# Altium schematic sheet Arduino幻彩灯带.SchDoc
size A3
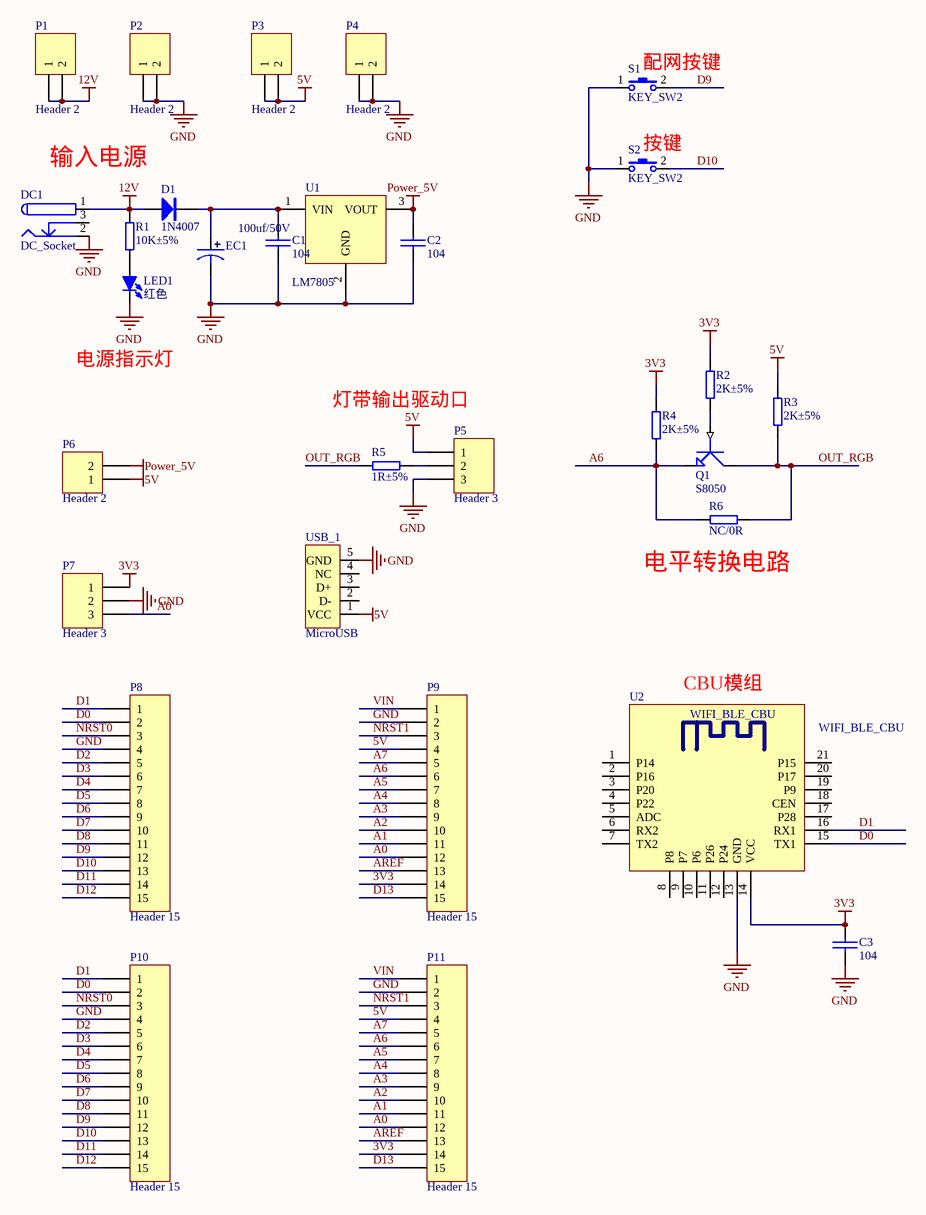
[diagram p0: Arduino幻彩灯带.SchDoc]

## Parts
C1  104  [0805C]
C2  104  [0805C]
C3  104  [0805C]
D1  1N4007  [SMA]
DC1  DC_Socket  [DC-005]
EC1  100uf/50V  [DIP-EC3.5X8X11.5]
LED1  红色  [LED 0603R]
P1  Header 2  [HDR1X2]
P2  Header 2  [HDR1X2]
P3  Header 2  [HDR1X2]
P4  Header 2  [HDR1X2]
P5  Header 3  [HDR1X3]
P6  Header 2  [HDR1X2]
P7  Header 3  [HDR1X3]
P8  Header 15  [HDR1X15]
P9  Header 15  [HDR1X15]
P10  Header 15  [HDR1X15]
P11  Header 15  [HDR1X15]
Q1  S8050  [SOT-23-NPN]
R1  10K±5%  [R0805]
R2  2K±5%  [R0603]
R3  2K±5%  [R0603]
R4  2K±5%  [R0603]
R5  1R±5%  [R0603]
R6  NC/0R  [R0603]
S1  KEY_SW2  [KEY4-SMD]
S2  KEY_SW2  [KEY4-SMD]
U1  LM7805  [TO252]
U2  WIFI_BLE_CBU  [WIFI_BLE_CBU]
USB_1  MicroUSB  [USB-micro_A]

## Nets
3V3: C3.1 P7.1 P9.14 P11.14 R2.1 R4.1 U2.14(VCC)
5V: P3.1 P3.2 P5.1 P6.1 P9.4 P11.4 R3.1 USB_1.1(VCC)
12V: D1.1(A) DC1.1 P1.1 P1.2 R1.1
GND: C1.1 C2.1 C3.2 DC1.2 EC1.2 LED1.2(K) P2.1 P2.2 P4.1 P4.2 P5.3 P7.2 P8.4 P9.2 P10.4 P11.2 S1.1 S2.1 U1.2(GND) U2.13(GND) USB_1.5(GND)
Power_5V: C2.2 P6.2 U1.3(VOUT)
A0: P7.3 P9.12 P11.12
A1: P9.11 P11.11
A2: P9.10 P11.10
A3: P9.9 P11.9
A4: P9.8 P11.8
A5: P9.7 P11.7
A6: P9.6 P11.6 Q1.1(E) R4.2 R6.1
A7: P9.5 P11.5
AREF: P9.13 P11.13
D0: P8.2 P10.2 U2.15(TX1)
D1: P8.1 P10.1 U2.16(RX1)
D2: P8.5 P10.5
D3: P8.6 P10.6
D4: P8.7 P10.7
D5: P8.8 P10.8
D6: P8.9 P10.9
D7: P8.10 P10.10
D8: P8.11 P10.11
D9: P8.12 P10.12 S1.2
D10: P8.13 P10.13 S2.2
D11: P8.14 P10.14
D12: P8.15 P10.15
D13: P9.15 P11.15
NRST0: P8.3 P10.3
NRST1: P9.3 P11.3
OUT_RGB: Q1.3(C) R3.2 R5.1 R6.2
VIN: P9.1 P11.1
NetC1_2: C1.2 D1.2(K) EC1.1 U1.1(VIN)
NetLED1_1: LED1.1(A) R1.2
NetP5_2: P5.2 R5.2
NetQ1_2: Q1.2(B) R2.2

Not connected (* = marked no-connect by the designer): DC1 3; U2 1(P14) 2(P16) 3(P20) 4(P22) 5(ADC) 6(RX2) 7(TX2) 8(P8) 9(P7) 10(P6) 11(P26) 12(P24) 17(P28) 18(CEN) 19(P9) 20(P17) 21(P15); USB_1 2(D-) 3(D+) 4(NC)

## Notes on the sheet
- (near S1) 配网按键
- (near S2) 按键
- 输入电源
- 电源指示灯
- 灯带输出驱动口
- (near R6) 电平转换电路
- CBU模组

## Library data of the parts
C1-C3 = CAP: 无极性电容
D1 = 1N4007: 整流二极管
EC1 = DIP_ECAP: 直插电解电容
LED1 = LED-SMD: 贴片LED
P1-P4 P6 = Header 2: Header, 2-Pin; LatestRevisionDate: 17-Jul-2002; LatestRevisionNote: Re-released for DXP Platform.; Publisher: Altium Limited
P5 P7 = Header 3: Header, 3-Pin; LatestRevisionDate: 17-Jul-2002; LatestRevisionNote: Re-released for DXP Platform.; Publisher: Altium Limited
P8-P11 = Header 15: Header, 15-Pin; LatestRevisionDate: 17-Jul-2002; LatestRevisionNote: Re-released for DXP Platform.; Publisher: Altium Limited
Q1 = NPN: NPN Transistor
R1-R6 = RES5
U2 = WIFI_BLE_CBU: Module